# EAGLE design soundmonsters (EAGLE 9.1.1)
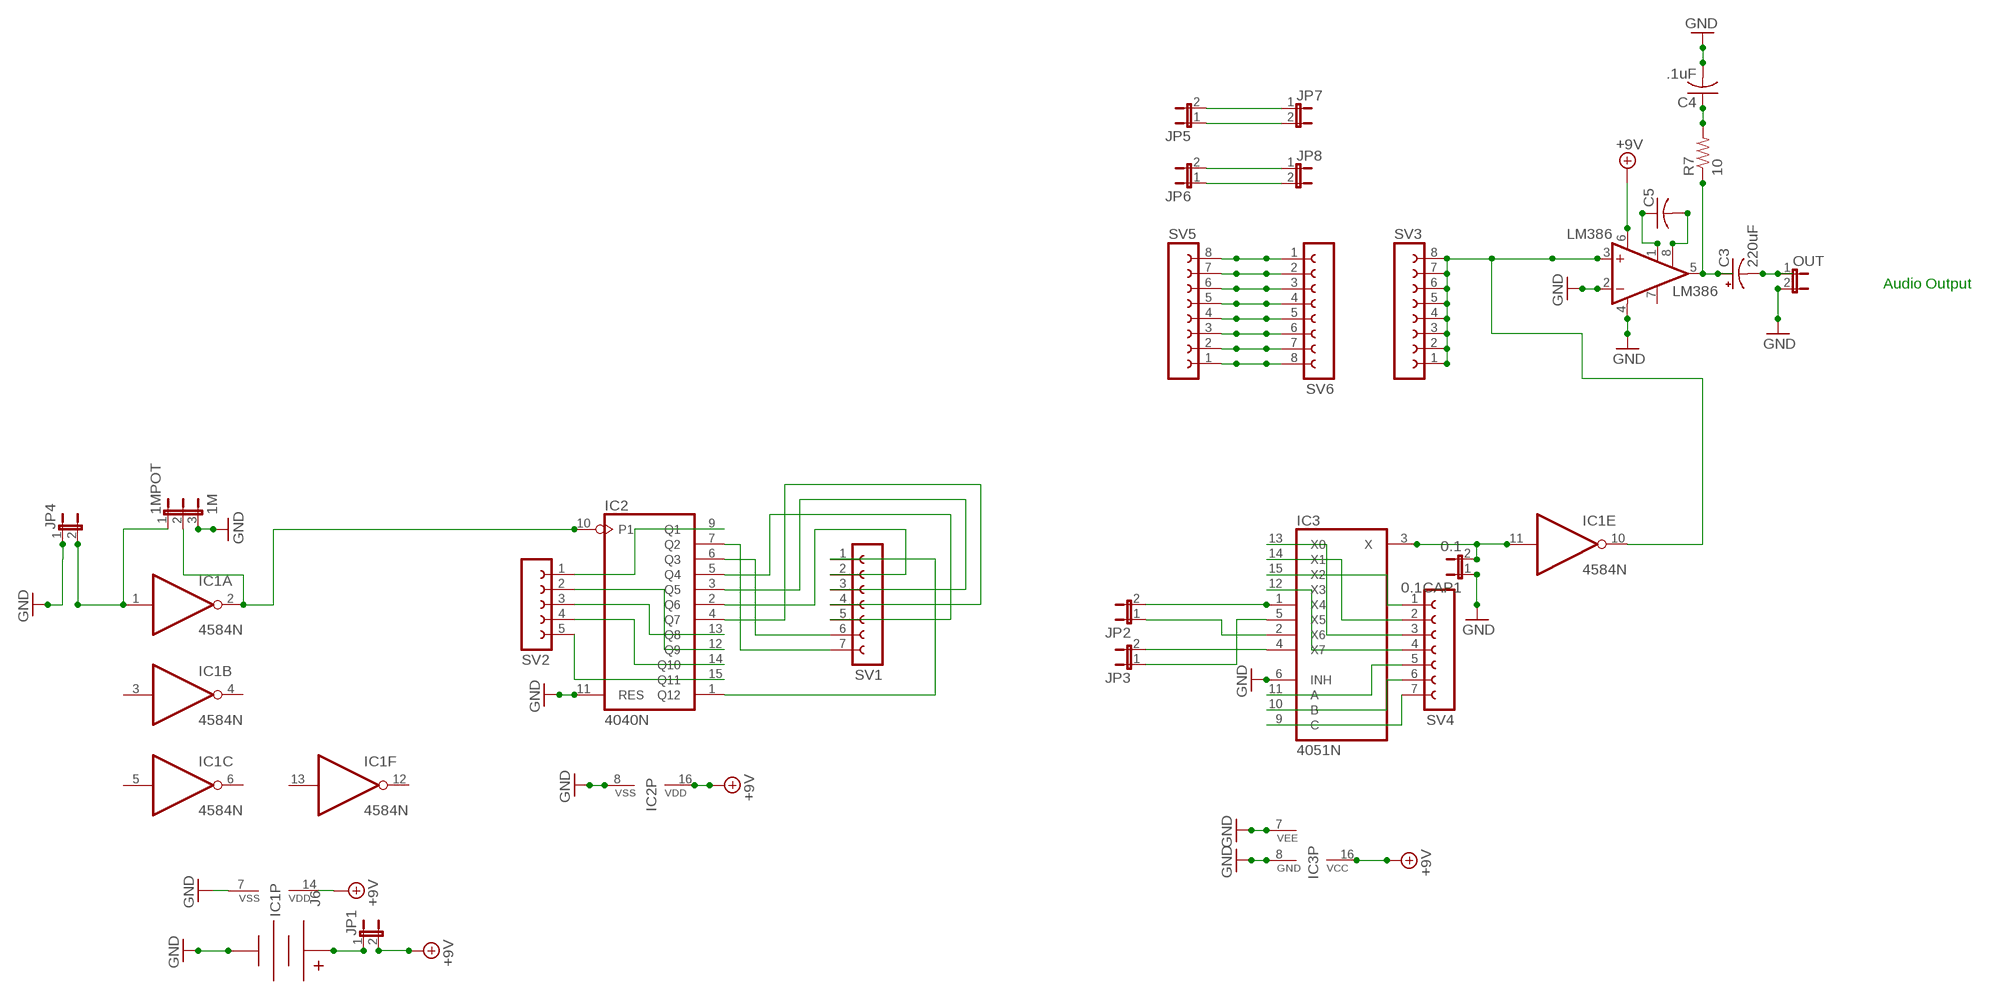
[diagram p0: schematic, sheet 1]

## Parts
0.1CAP1  0.1  JP1E  [JP1]
1MPOT  1M  JP2E  [JP2]
C3  220uF  CPOL-USE3.5-8  [E3,5-8]
C4  .1uF  C-US025-024X044  [C025-024X044]
C5  C-US025-024X044  [C025-024X044]
IC1  4584N  [DIL14]
IC2  4040N  [DIL16]
IC3  4051N  [DIL16]
J6  BC9VPC  [BC9VPC]
JP1  JP1E  [JP1]
JP2  JP1E  [JP1]
JP3  JP1E  [JP1]
JP4  JP1E  [JP1]
JP5  JP1E  [JP1]
JP6  JP1E  [JP1]
JP7  JP1E  [JP1]
JP8  JP1E  [JP1]
LM386  LM386  LM386N-1  [DIL08]
OUT  JP1E  [JP1]
R7  10  R-US_0204/7  [0204/7]
SV1  FE07-1  [FE07]
SV2  FE05-1  [FE05-1]
SV3  FE08-1  [FE08]
SV4  FE07-1  [FE07]
SV5  FE08-1  [FE08]
SV6  FE08-1  [FE08]

## Nets
+9V: IC1.14(P:VDD) IC2.16(VDD) IC3.16(VCC) JP1.2 LM386.6(VS)
GND: 0.1CAP1.1 1MPOT.3 C4.2 IC1.7(P:VSS) IC2.8(VSS) IC2.11(RES) IC3.6(INH) IC3.7(VEE) IC3.8(GND) J6.V- JP4.1 LM386.2(-IN) LM386.4(GND) OUT.2
N$1: 1MPOT.1 IC1.1(A:I) JP4.2
N$2: 1MPOT.2 IC1.2(A:O) IC2.10(P1)
N$3: IC3.1(X4) JP2.2
N$4: 0.1CAP1.2 IC1.11(E:I) IC3.3(X)
N$5: C5.1 LM386.1(GAIN)
N$6: IC2.1(Q12) SV1.1
N$7: IC2.2(Q6) SV1.2
N$8: IC2.3(Q5) SV1.3
N$9: IC2.4(Q7) SV1.4
N$10: C3.+ LM386.5(OUT) R7.1
N$11: C3.- OUT.1
N$12: IC2.5(Q4) SV1.5
N$13: C4.1 R7.2
N$14: C5.2 LM386.8(GAIN)
N$15: IC2.6(Q3) SV1.6
N$16: IC2.7(Q2) SV1.7
N$17: IC2.9(Q1) SV2.1
N$18: IC2.12(Q9) SV2.2
N$19: IC2.13(Q8) SV2.3
N$20: IC2.14(Q10) SV2.4
N$21: IC2.15(Q11) SV2.5
N$22: IC3.2(X6) JP2.1
N$23: IC3.4(X7) JP3.2
N$24: IC3.5(X5) JP3.1
N$25: IC3.9(C) SV4.7
N$26: IC3.10(B) SV4.6
N$27: IC3.11(A) SV4.5
N$28: IC3.12(X3) SV4.4
N$29: IC3.13(X0) SV4.3
N$30: IC3.14(X1) SV4.2
N$31: IC3.15(X2) SV4.1
N$32: SV5.8 SV6.1
N$33: SV5.7 SV6.2
N$34: SV5.6 SV6.3
N$35: SV5.5 SV6.4
N$36: SV5.4 SV6.5
N$37: SV5.3 SV6.6
N$38: SV5.2 SV6.7
N$39: SV5.1 SV6.8
N$40: JP5.2 JP7.1
N$41: IC1.10(E:O) LM386.3(+IN) SV3.1 SV3.2 SV3.3 SV3.4 SV3.5 SV3.6 SV3.7 SV3.8
N$42: JP5.1 JP7.2
N$43: JP6.2 JP8.1
N$44: JP6.1 JP8.2
N$45: J6.V+ JP1.1
Unconnected: IC1.3(B:I) IC1.4(B:O) IC1.5(C:I) IC1.6(C:O) IC1.8(D:O) IC1.9(D:I) IC1.12(F:O) IC1.13(F:I) LM386.7(BYPASS)

## Notes on the sheet
- Audio Output

## Library data of the parts
0.1CAP1 JP1-JP8 OUT = jumper:JP1E: JUMPER
1MPOT = jumper:JP2E: JUMPER
C3 = rcl:CPOL-US: POLARIZED CAPACITOR, American symbol
C4 C5 = resistor:C-US: CAPACITOR, American symbol
IC1 = 45xx:4584: Hex SCHMITT TRIGGER (74C14)
IC2 = 40xx:4040: 12-stage binary/ripple COUNTER
IC3 = 40xx:4051: 8-channel ANALOG MULTIPLEXER
J6 = SparkFun-Connectors:BC9VPC: 9V Battery Holder - PC Mount Standard and Kit footprints included SparkFun Products: SparkFun SparkPunk Sound Kit <https://www.sparkfun.com/products/11177> SparkFun SparkPunk Sequencer Kit <https://www.sparkfun.com/products/12707>; PROD_ID: BATT-10855
LM386 = linear:LM386?-*: Low Voltage Audio Power Amplifier Source: http://cache.national.com/ds/LM/LM386.pdf
R7 = resistor:R-US_: RESISTOR, American symbol
SV1 SV4 = con-lsta:FE07-1: FEMALE HEADER; OC_FARNELL: unknown; OC_NEWARK: unknown
SV2 = con-lsta:FE05-1: FEMALE HEADER; OC_FARNELL: unknown; OC_NEWARK: unknown
SV3 SV5 SV6 = con-lsta:FE08-1: FEMALE HEADER; OC_FARNELL: unknown; OC_NEWARK: unknown

## Board
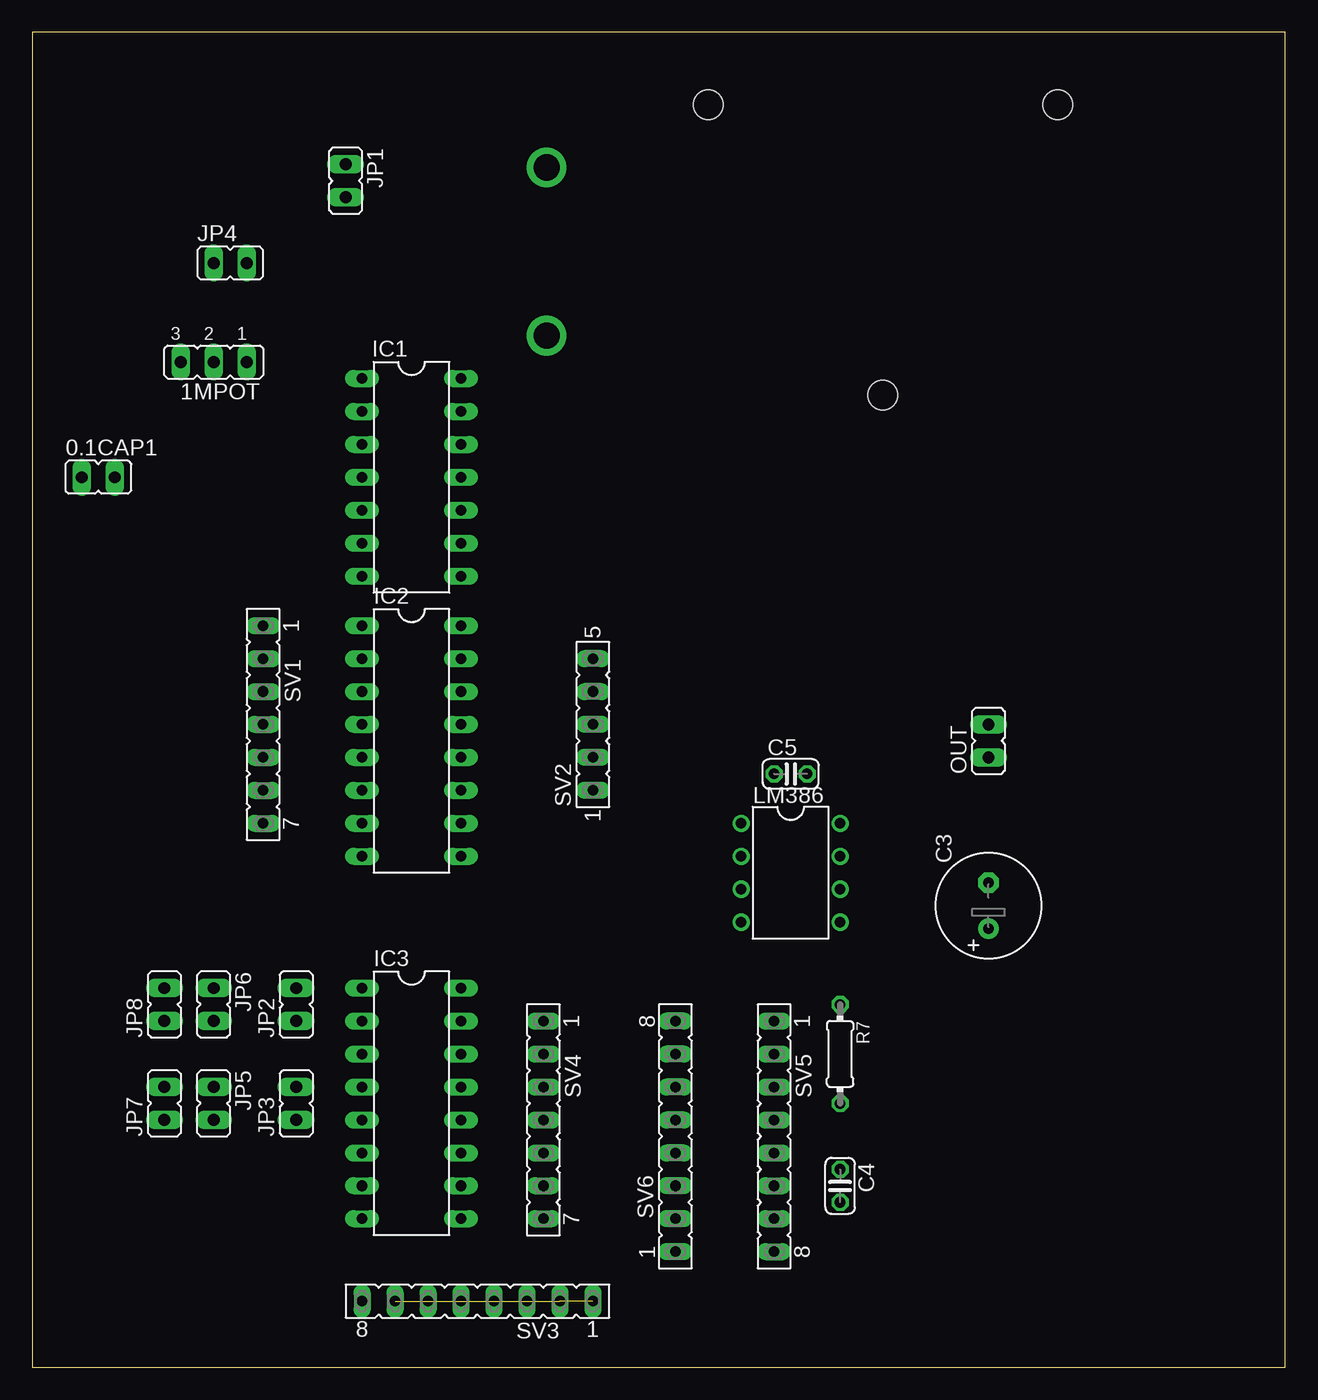
[diagram p1: board, top side]
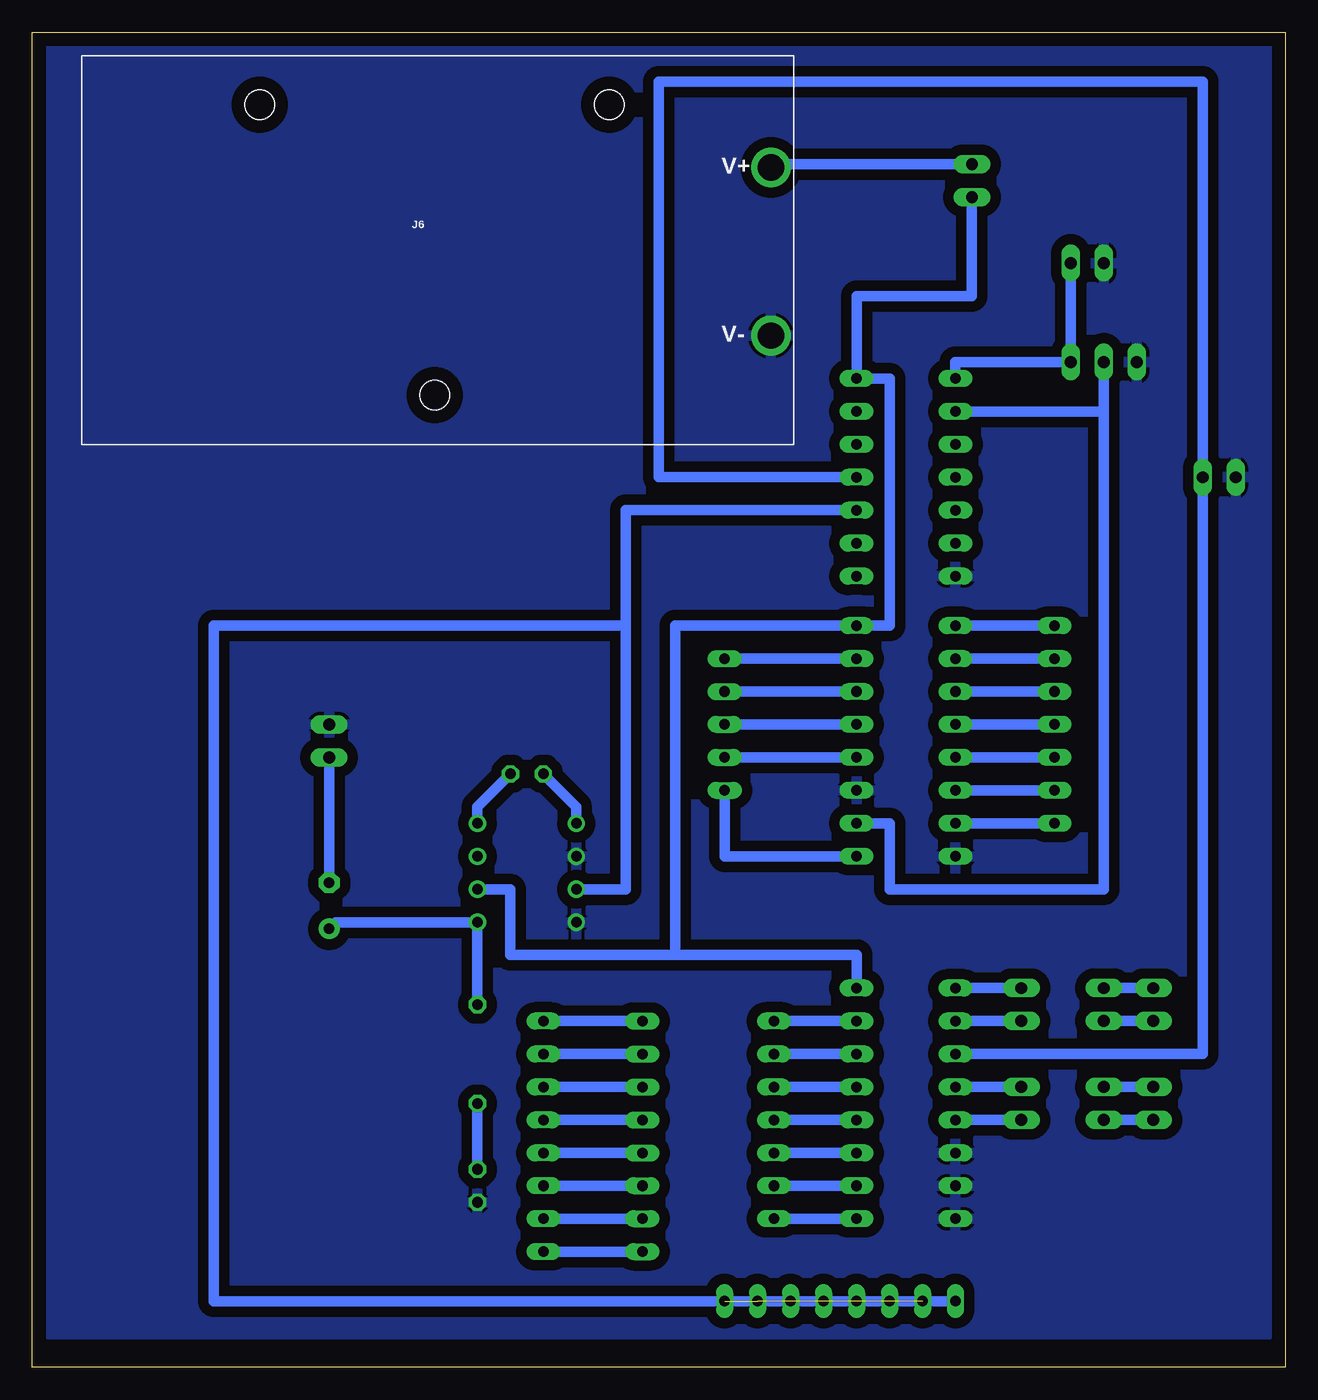
[diagram p2: board, bottom side, seen from below]

Size 96.52 x 102.87 mm. Coordinates in mm from the lower left corner, seen from the top.
Outline: 0,0 96.52,0 96.52,102.87 0,102.87 0,0
Copper layers (1*16): Top 0.035mm / dielectric 1.5mm / Bottom 0.035mm
Design rules "default": minimum track width 6mil, minimum drill 0.35mm, track to track 6mil, track to pad 6mil, pad to pad 6mil, via to via 6mil, smd to smd 6mil, copper to edge 40mil, drill to drill 6mil, minimum pad ring 10mil, minimum via ring 8mil, stop-mask expansion 4mil, vias tented up to drill 0mil, thermal gap 10mil

### Footprints (pad centres in the part's own frame; a part is rotated, then mirrored left to right if it is on the bottom)
JP1 = drill 0.914 long: 1 0,-1.27; 2 0,1.27
JP2 = drill 0.914 long: 1 -2.54,0; 2 0,0; 3 2.54,0
E3,5-8 = drill 0.813 pad 1.6: + -1.778,0 | drill 0.813 pad 1.6 octagon: - 1.778,0
C025-024X044 = drill 0.813 octagon: 1 -1.27,0; 2 1.27,0
DIL14 = drill 0.813 long: 1 -7.62,-3.81; 2 -5.08,-3.81; 3 -2.54,-3.81; 4 0,-3.81; 5 2.54,-3.81; 6 5.08,-3.81; 7 7.62,-3.81; 8 7.62,3.81; 9 5.08,3.81; 10 2.54,3.81; 11 0,3.81; 12 -2.54,3.81; 13 -5.08,3.81; 14 -7.62,3.81
DIL16 = drill 0.813 long: 1 -8.89,-3.81; 2 -6.35,-3.81; 3 -3.81,-3.81; 4 -1.27,-3.81; 5 1.27,-3.81; 6 3.81,-3.81; 7 6.35,-3.81; 8 8.89,-3.81; 9 8.89,3.81; 10 6.35,3.81; 11 3.81,3.81; 12 1.27,3.81; 13 -1.27,3.81; 14 -3.81,3.81; 15 -6.35,3.81; 16 -8.89,3.81
BC9VPC = drill 2.032: V+ 53.086,21.336; V- 53.086,8.382 | hole 2.286: 27.178,3.81; 13.716,26.162; 40.64,26.162
DIL08 = drill 0.813 pad 1.27: 1 -3.81,-3.81; 2 -1.27,-3.81; 3 1.27,-3.81; 4 3.81,-3.81; 5 3.81,3.81; 6 1.27,3.81; 7 -1.27,3.81; 8 -3.81,3.81
0204/7 = drill 0.813 octagon: 1 -3.81,0; 2 3.81,0
FE07 = drill 0.813 long: 1 -7.62,0; 2 -5.08,0; 3 -2.54,0; 4 0,0; 5 2.54,0; 6 5.08,0; 7 7.62,0
FE05-1 = drill 0.813 long: 1 -5.08,0; 2 -2.54,0; 3 0,0; 4 2.54,0; 5 5.08,0
FE08 = drill 0.813 long: 1 -8.89,0; 2 -6.35,0; 3 -3.81,0; 4 -1.27,0; 5 1.27,0; 6 3.81,0; 7 6.35,0; 8 8.89,0

### Placement (x,y rotation side)
0.1CAP1  5.08,68.58 270 top
1MPOT  13.97,77.47 180 top
C3  73.66,35.56 90 top
C4  62.23,13.97 270 top
C5  58.42,45.72 0 top
IC1  29.21,68.58 270 top
IC2  29.21,48.26 270 top
IC3  29.21,20.32 270 top
J6  92.71,71.12 0 bottom
JP1  24.13,91.44 180 top
JP2  20.32,27.94 0 top
JP3  20.32,20.32 0 top
JP4  15.24,85.09 270 top
JP5  13.97,20.32 180 top
JP6  13.97,27.94 180 top
JP7  10.16,20.32 0 top
JP8  10.16,27.94 0 top
LM386  58.42,38.1 270 top
OUT  73.66,48.26 0 top
R7  62.23,24.13 270 top
SV1  17.78,49.53 270 top
SV2  43.18,49.53 90 top
SV3  34.29,5.08 180 top
SV4  39.37,19.05 270 top
SV5  57.15,17.78 270 top
SV6  49.53,17.78 90 top

### Tracks (layer width: path | path; a pad name or v marks a point on that pad's centre or on a via)
+9V
  Bottom 0.813: LM386.6 59.69,36.83 59.69,31.75 46.99,31.75 | 46.99,31.75 46.99,57.15 IC2.16 30.48,57.15 30.48,76.2 IC1.14 33.02,82.55 24.13,82.55 JP1.2 | 46.99,31.75 33.02,31.75 IC3.16
GND
  pour Bottom (isolate 0.813): 1.27,2.54 1.27,101.6 95.25,101.6 95.25,2.54
N$1
  Bottom 0.813: IC1.1 25.4,77.47 1MPOT.1 JP4.2
N$2
  Bottom 0.813: 13.97,73.66 IC1.2 | IC2.10 30.48,41.91 30.48,36.83 13.97,36.83 13.97,69.85 13.97,70.38 13.97,73.66 | 1MPOT.2 13.97,73.66
N$3
  Bottom 0.813: JP2.2 IC3.1
N$4
  Bottom 0.813: IC3.3 6.35,24.13 0.1CAP1.2 6.35,99.06 48.26,99.06 48.26,68.58 IC1.11
N$5
  Bottom 0.813: LM386.1 54.61,43.18 C5.1
N$6
  Bottom 0.813: SV1.1 IC2.1
N$7
  Bottom 0.813: SV1.2 IC2.2
N$8
  Bottom 0.813: SV1.3 IC2.3
N$9
  Bottom 0.813: SV1.4 IC2.4
N$10
  Bottom 0.813: C3.+ 73.15,34.29 LM386.5 R7.1
N$11
  Bottom 0.813: C3.- OUT.1
N$12
  Bottom 0.813: SV1.5 IC2.5
N$13
  Bottom 0.813: R7.2 C4.1
N$14
  Bottom 0.813: LM386.8 62.23,43.18 C5.2
N$15
  Bottom 0.813: SV1.6 IC2.6
N$16
  Bottom 0.813: SV1.7 IC2.7
N$17
  Bottom 0.813: IC2.9 43.18,39.37 SV2.1
N$18
  Bottom 0.813: IC2.12 SV2.2
N$19
  Bottom 0.813: IC2.13 SV2.3
N$20
  Bottom 0.813: IC2.14 SV2.4
N$21
  Bottom 0.813: IC2.15 SV2.5
N$22
  Bottom 0.813: JP2.1 IC3.2
N$23
  Bottom 0.813: JP3.2 IC3.4
N$24
  Bottom 0.813: JP3.1 IC3.5
N$25
  Bottom 0.813: IC3.9 SV4.7
N$26
  Bottom 0.813: IC3.10 SV4.6
N$27
  Bottom 0.813: IC3.11 SV4.5
N$28
  Bottom 0.813: IC3.12 SV4.4
N$29
  Bottom 0.813: IC3.13 SV4.3
N$30
  Bottom 0.813: IC3.14 SV4.2
N$31
  Bottom 0.813: IC3.15 SV4.1
N$32
  Bottom 0.813: SV6.1 SV5.8
N$33
  Bottom 0.813: SV6.2 SV5.7
N$34
  Bottom 0.813: SV6.3 SV5.6
N$35
  Bottom 0.813: SV6.4 SV5.5
N$36
  Bottom 0.813: SV6.5 SV5.4
N$37
  Bottom 0.813: SV6.6 SV5.3
N$38
  Bottom 0.813: SV6.7 SV5.2
N$39
  Bottom 0.813: SV6.8 SV5.1
N$40
  Bottom 0.813: JP7.1 JP5.2
N$41  (6 unrouted)
  Bottom 0.813: SV3.8 SV3.1 82.55,5.08 82.55,57.15 50.8,57.15 | LM386.3 50.8,36.83 50.8,49.53 50.8,57.15 | IC1.10 50.8,66.04 50.8,57.15
N$42
  Bottom 0.813: JP7.2 JP5.1
N$43
  Bottom 0.813: JP6.2 JP8.1
N$44
  Bottom 0.813: JP6.1 JP8.2
N$45
  Bottom 0.813: JP1.1 39.37,92.71 J6.V+